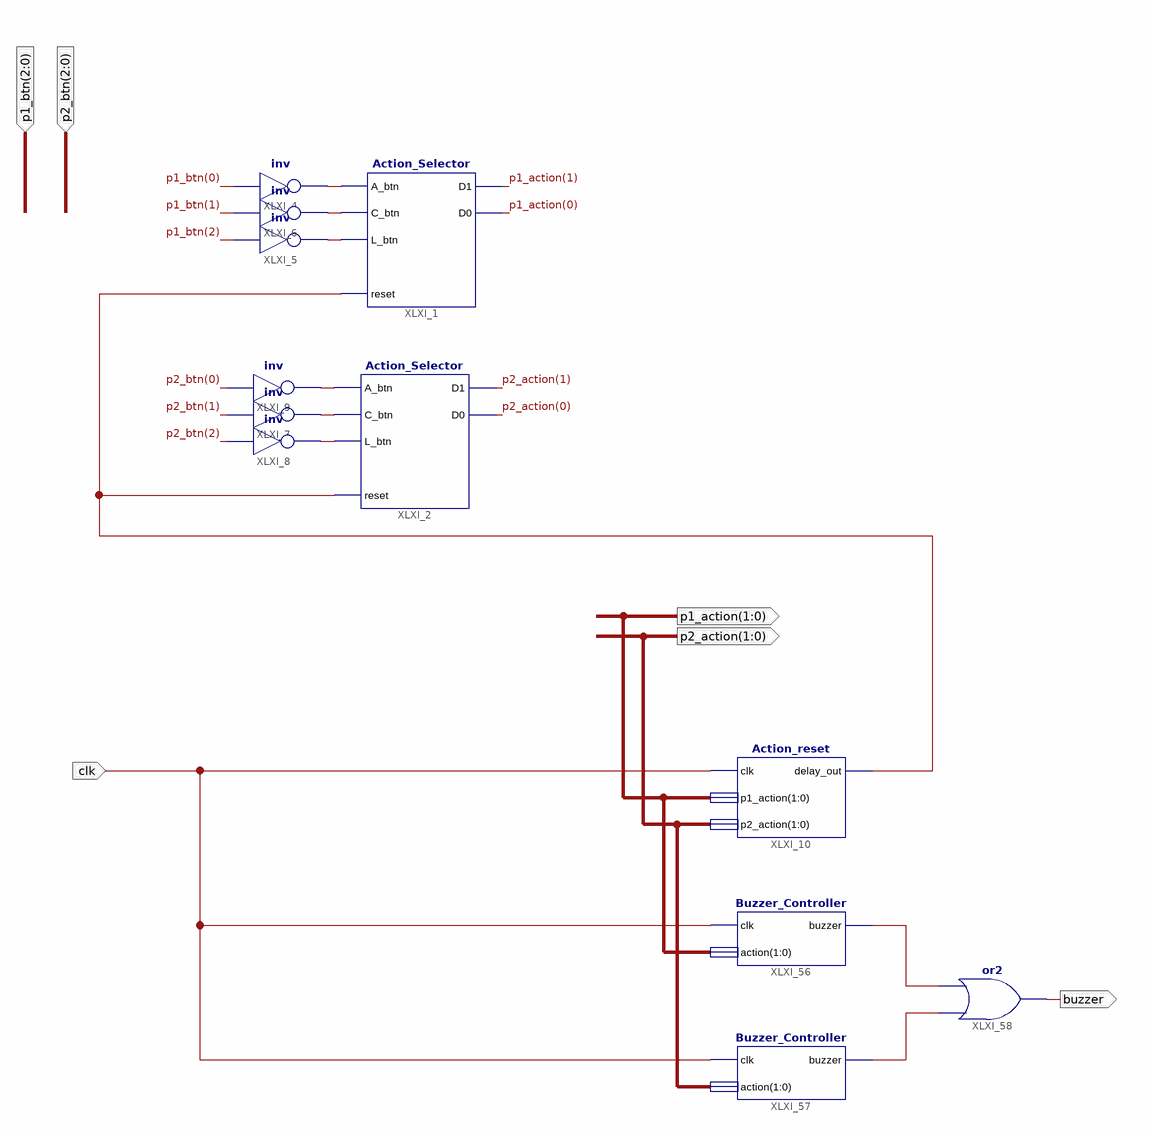
[diagram p0: schematic sheet 1]
// Xilinx ISE schematic Digital_Logic_Battle_Input.sch (spartan6) as structural Verilog: 12 symbols, 6 ports
module Digital_Logic_Battle_Input (
  input  [2:0] p1_btn,
  input  [2:0] p2_btn,
  input  clk,
  output [1:0] p1_action,
  output buzzer,
  output [1:0] p2_action
);

  wire reset, XLXN_1, XLXN_2, XLXN_3, XLXN_4, XLXN_5, XLXN_6, XLXN_130, XLXN_131;

  Action_Selector XLXI_1 (
    .A_btn(XLXN_1), .L_btn(XLXN_2), .C_btn(XLXN_3), .reset(reset), .D1(p1_action[1]), .D0(p1_action[0]));
  Action_Selector XLXI_2 (
    .A_btn(XLXN_6), .L_btn(XLXN_5), .C_btn(XLXN_4), .reset(reset), .D1(p2_action[1]), .D0(p2_action[0]));
  not XLXI_4 (XLXN_1, p1_btn[0]);
  not XLXI_5 (XLXN_2, p1_btn[2]);
  not XLXI_6 (XLXN_3, p1_btn[1]);
  not XLXI_7 (XLXN_4, p2_btn[1]);
  not XLXI_8 (XLXN_5, p2_btn[2]);
  not XLXI_9 (XLXN_6, p2_btn[0]);
  Action_reset XLXI_10 (.clk(clk), .p1_action(p1_action), .p2_action(p2_action), .delay_out(reset));
  Buzzer_Controller XLXI_56 (.clk(clk), .action(p1_action), .buzzer(XLXN_130));
  Buzzer_Controller XLXI_57 (.clk(clk), .action(p2_action), .buzzer(XLXN_131));
  or XLXI_58 (buzzer, XLXN_131, XLXN_130);
endmodule
